# EAGLE design PGTNX02_2164_vcax4 (EAGLE 9.6.0)
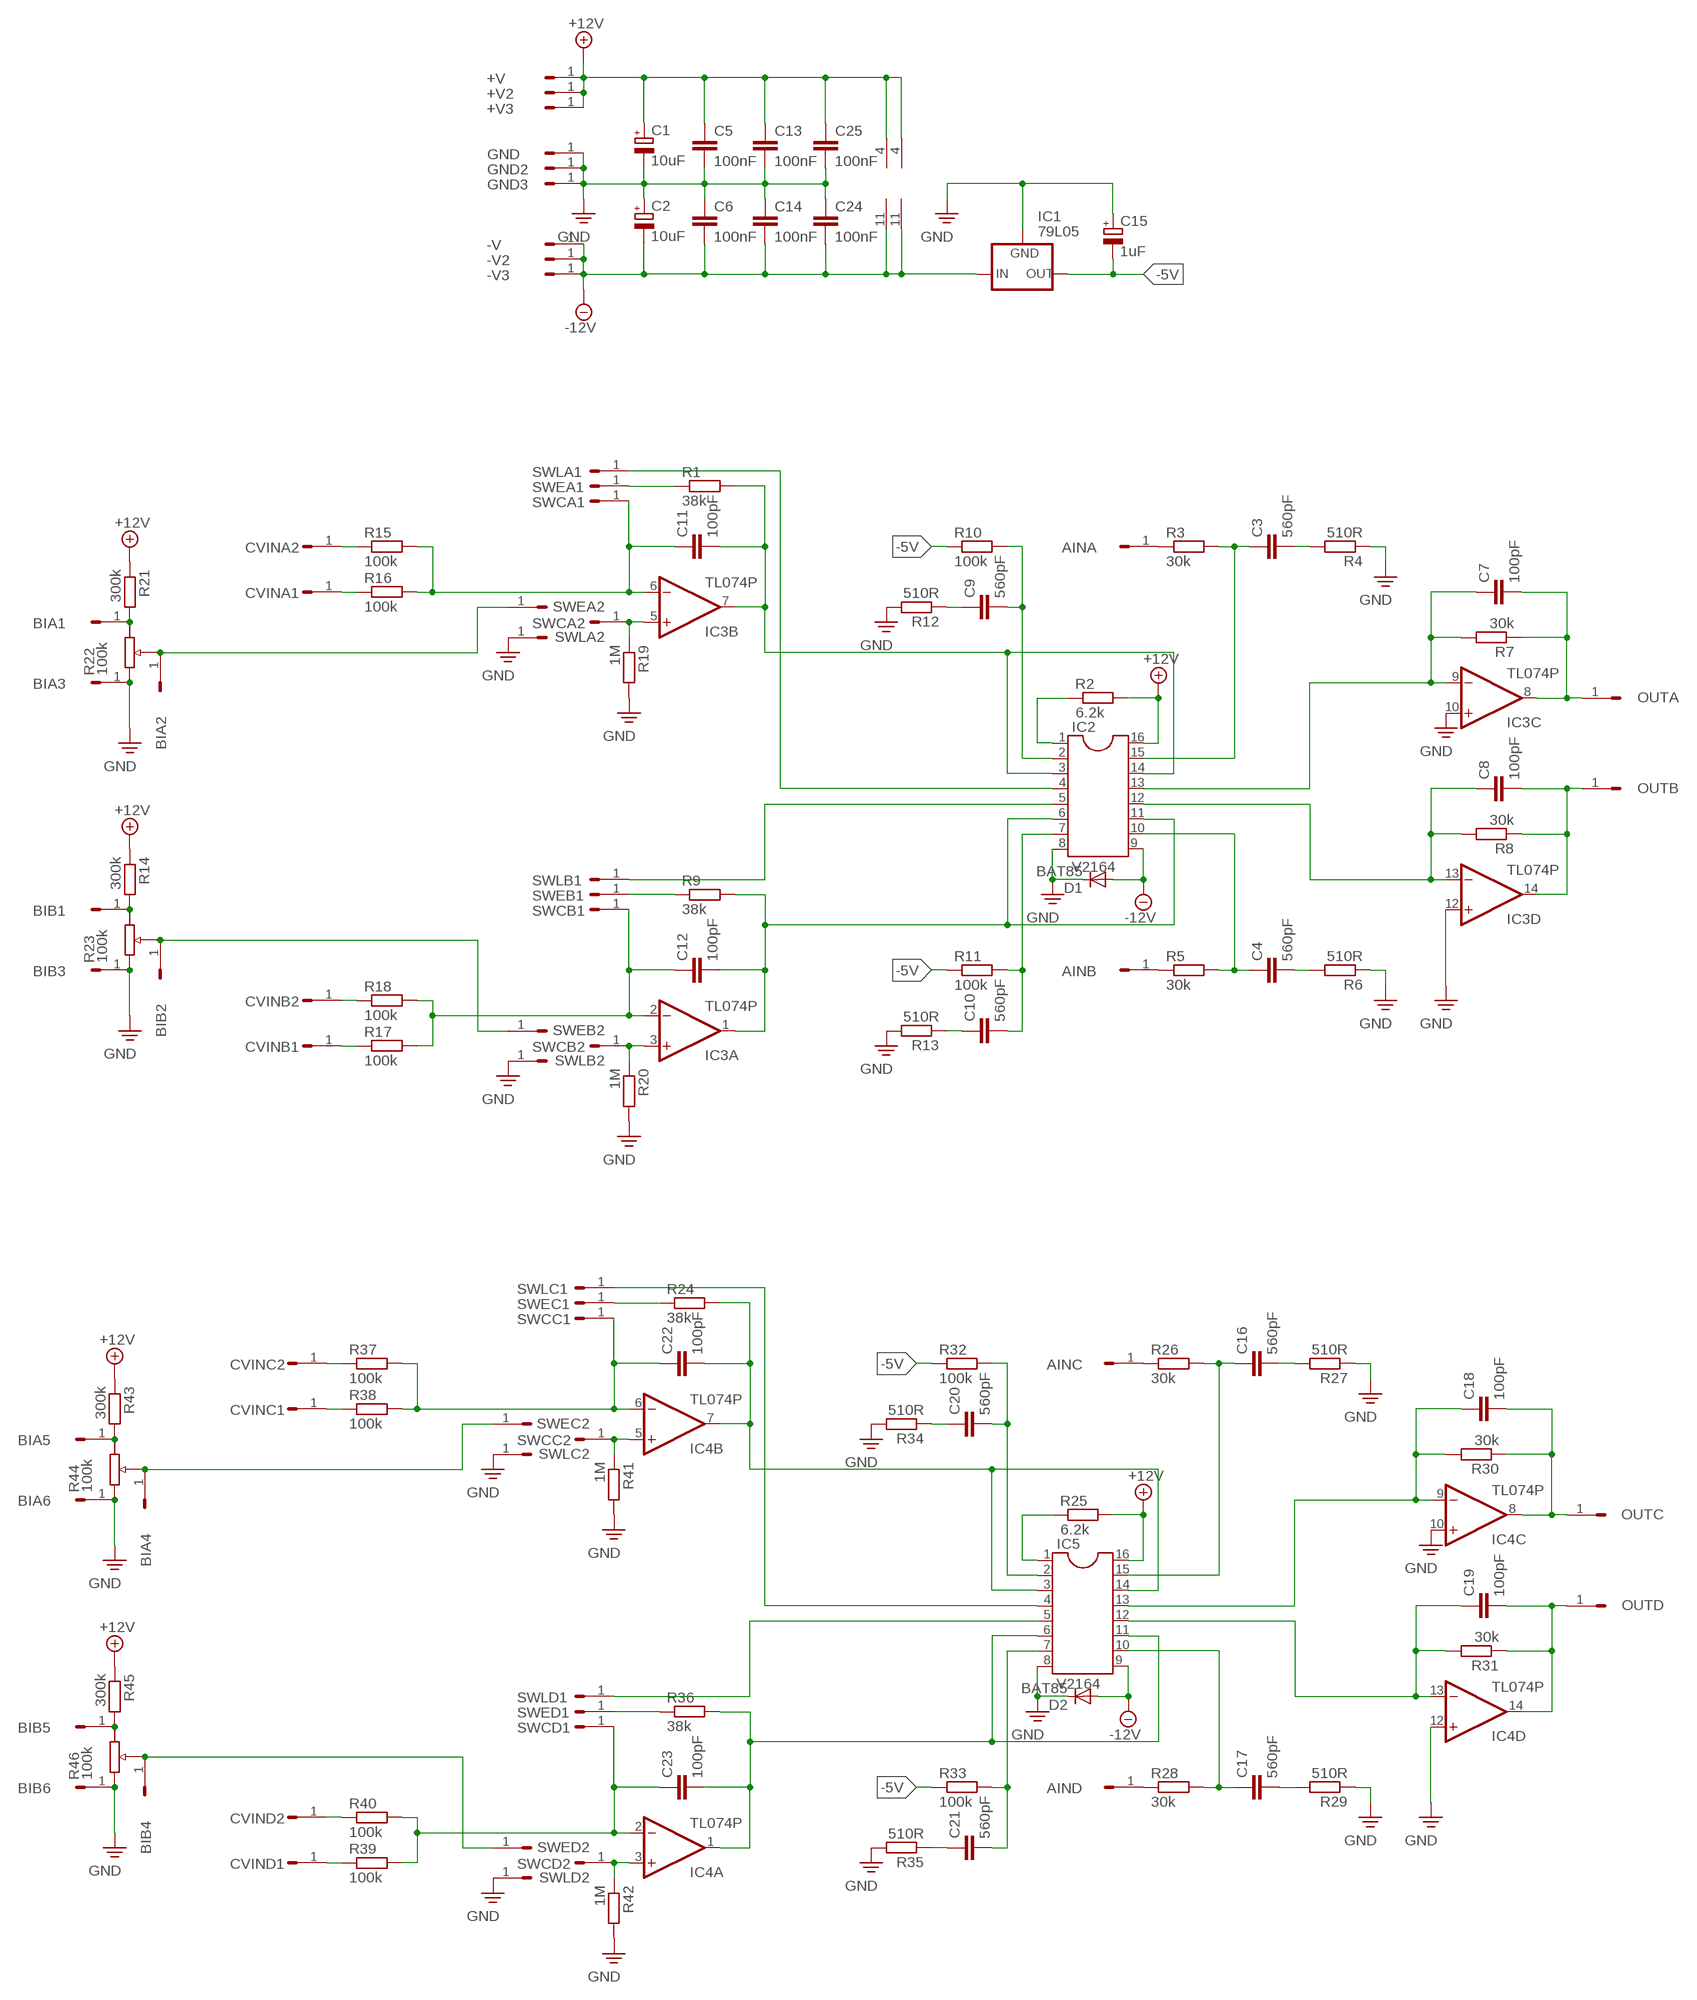
[diagram p0: schematic, sheet 1]

## Parts
+V  HEADER/MALE/01  [HEADER/MALE/01]
+V2  HEADER/MALE/01  [HEADER/MALE/01]
+V3  HEADER/MALE/01  [HEADER/MALE/01]
-V  HEADER/MALE/01  [HEADER/MALE/01]
-V2  HEADER/MALE/01  [HEADER/MALE/01]
-V3  HEADER/MALE/01  [HEADER/MALE/01]
AINA  HEADER/MALE/01  [HEADER/MALE/01]
AINB  HEADER/MALE/01  [HEADER/MALE/01]
AINC  HEADER/MALE/01  [HEADER/MALE/01]
AIND  HEADER/MALE/01  [HEADER/MALE/01]
BIA1  HEADER/MALE/01  [HEADER/MALE/01]
BIA2  HEADER/MALE/01  [HEADER/MALE/01]
BIA3  HEADER/MALE/01  [HEADER/MALE/01]
BIA4  HEADER/MALE/01  [HEADER/MALE/01]
BIA5  HEADER/MALE/01  [HEADER/MALE/01]
BIA6  HEADER/MALE/01  [HEADER/MALE/01]
BIB1  HEADER/MALE/01  [HEADER/MALE/01]
BIB2  HEADER/MALE/01  [HEADER/MALE/01]
BIB3  HEADER/MALE/01  [HEADER/MALE/01]
BIB4  HEADER/MALE/01  [HEADER/MALE/01]
BIB5  HEADER/MALE/01  [HEADER/MALE/01]
BIB6  HEADER/MALE/01  [HEADER/MALE/01]
C1  10uF  CAPACITOR/POLARIZEDE2.5-6  [E2,5-6]
C2  10uF  CAPACITOR/POLARIZEDE2.5-6  [E2,5-6]
C3  560pF  CAPACITORCERAMICDISC/5  [CERAMICDISC/5]
C4  560pF  CAPACITORCERAMICDISC/5  [CERAMICDISC/5]
C5  100nF  CAPACITORCERAMICDISC/5  [CERAMICDISC/5]
C6  100nF  CAPACITORCERAMICDISC/5  [CERAMICDISC/5]
C7  100pF  CAPACITORCERAMICDISC/5  [CERAMICDISC/5]
C8  100pF  CAPACITORCERAMICDISC/5  [CERAMICDISC/5]
C9  560pF  CAPACITORCERAMICDISC/5  [CERAMICDISC/5]
C10  560pF  CAPACITORCERAMICDISC/5  [CERAMICDISC/5]
C11  100pF  CAPACITORCERAMICDISC/5  [CERAMICDISC/5]
C12  100pF  CAPACITORCERAMICDISC/5  [CERAMICDISC/5]
C13  100nF  CAPACITORCERAMICDISC/5  [CERAMICDISC/5]
C14  100nF  CAPACITORCERAMICDISC/5  [CERAMICDISC/5]
C15  1uF  CAPACITOR/POLARIZEDE2.5-6  [E2,5-6]
C16  560pF  CAPACITORCERAMICDISC/5  [CERAMICDISC/5]
C17  560pF  CAPACITORCERAMICDISC/5  [CERAMICDISC/5]
C18  100pF  CAPACITORCERAMICDISC/5  [CERAMICDISC/5]
C19  100pF  CAPACITORCERAMICDISC/5  [CERAMICDISC/5]
C20  560pF  CAPACITORCERAMICDISC/5  [CERAMICDISC/5]
C21  560pF  CAPACITORCERAMICDISC/5  [CERAMICDISC/5]
C22  100pF  CAPACITORCERAMICDISC/5  [CERAMICDISC/5]
C23  100pF  CAPACITORCERAMICDISC/5  [CERAMICDISC/5]
C24  100nF  CAPACITORCERAMICDISC/5  [CERAMICDISC/5]
C25  100nF  CAPACITORCERAMICDISC/5  [CERAMICDISC/5]
CVINA1  HEADER/MALE/01  [HEADER/MALE/01]
CVINA2  HEADER/MALE/01  [HEADER/MALE/01]
CVINB1  HEADER/MALE/01  [HEADER/MALE/01]
CVINB2  HEADER/MALE/01  [HEADER/MALE/01]
CVINC1  HEADER/MALE/01  [HEADER/MALE/01]
CVINC2  HEADER/MALE/01  [HEADER/MALE/01]
CVIND1  HEADER/MALE/01  [HEADER/MALE/01]
CVIND2  HEADER/MALE/01  [HEADER/MALE/01]
D1  BAT85  1N4148DO35-7  [DO35-7]
D2  BAT85  1N4148DO35-7  [DO35-7]
GND  HEADER/MALE/01  [HEADER/MALE/01]
GND2  HEADER/MALE/01  [HEADER/MALE/01]
GND3  HEADER/MALE/01  [HEADER/MALE/01]
IC1  79L05  79LXX  [79LXX]
IC2  V2164  DIL16  [DIL16]
IC3  TL074P  [DIL14]
IC4  TL074P  [DIL14]
IC5  V2164  DIL16  [DIL16]
OUTA  HEADER/MALE/01  [HEADER/MALE/01]
OUTB  HEADER/MALE/01  [HEADER/MALE/01]
OUTC  HEADER/MALE/01  [HEADER/MALE/01]
OUTD  HEADER/MALE/01  [HEADER/MALE/01]
R1  38k  RESISTORRESISTOR/UPRIGHT/7.5  [RESISTOR/7.5]
R2  6.2k  RESISTORRESISTOR/UPRIGHT/7.5  [RESISTOR/7.5]
R3  30k  RESISTORRESISTOR/UPRIGHT/7.5  [RESISTOR/7.5]
R4  510R  RESISTORRESISTOR/UPRIGHT/7.5  [RESISTOR/7.5]
R5  30k  RESISTORRESISTOR/UPRIGHT/7.5  [RESISTOR/7.5]
R6  510R  RESISTORRESISTOR/UPRIGHT/7.5  [RESISTOR/7.5]
R7  30k  RESISTORRESISTOR/UPRIGHT/7.5  [RESISTOR/7.5]
R8  30k  RESISTORRESISTOR/UPRIGHT/7.5  [RESISTOR/7.5]
R9  38k  RESISTORRESISTOR/UPRIGHT/7.5  [RESISTOR/7.5]
R10  100k  RESISTORRESISTOR/UPRIGHT/7.5  [RESISTOR/7.5]
R11  100k  RESISTORRESISTOR/UPRIGHT/7.5  [RESISTOR/7.5]
R12  510R  RESISTORRESISTOR/UPRIGHT/7.5  [RESISTOR/7.5]
R13  510R  RESISTORRESISTOR/UPRIGHT/7.5  [RESISTOR/7.5]
R14  300k  RESISTORRESISTOR/UPRIGHT/7.5  [RESISTOR/7.5]
R15  100k  RESISTORRESISTOR/UPRIGHT/7.5  [RESISTOR/7.5]
R16  100k  RESISTORRESISTOR/UPRIGHT/7.5  [RESISTOR/7.5]
R17  100k  RESISTORRESISTOR/UPRIGHT/7.5  [RESISTOR/7.5]
R18  100k  RESISTORRESISTOR/UPRIGHT/7.5  [RESISTOR/7.5]
R19  1M  RESISTORRESISTOR/UPRIGHT/7.5  [RESISTOR/7.5]
R20  1M  RESISTORRESISTOR/UPRIGHT/7.5  [RESISTOR/7.5]
R21  300k  RESISTORRESISTOR/UPRIGHT/7.5  [RESISTOR/7.5]
R22  100k  POTENTIOMETER  (no package)
R23  100k  POTENTIOMETER  (no package)
R24  38k  RESISTORRESISTOR/UPRIGHT/7.5  [RESISTOR/7.5]
R25  6.2k  RESISTORRESISTOR/UPRIGHT/7.5  [RESISTOR/7.5]
R26  30k  RESISTORRESISTOR/UPRIGHT/7.5  [RESISTOR/7.5]
R27  510R  RESISTORRESISTOR/UPRIGHT/7.5  [RESISTOR/7.5]
R28  30k  RESISTORRESISTOR/UPRIGHT/7.5  [RESISTOR/7.5]
R29  510R  RESISTORRESISTOR/UPRIGHT/7.5  [RESISTOR/7.5]
R30  30k  RESISTORRESISTOR/UPRIGHT/7.5  [RESISTOR/7.5]
R31  30k  RESISTORRESISTOR/UPRIGHT/7.5  [RESISTOR/7.5]
R32  100k  RESISTORRESISTOR/UPRIGHT/7.5  [RESISTOR/7.5]
R33  100k  RESISTORRESISTOR/UPRIGHT/7.5  [RESISTOR/7.5]
R34  510R  RESISTORRESISTOR/UPRIGHT/7.5  [RESISTOR/7.5]
R35  510R  RESISTORRESISTOR/UPRIGHT/7.5  [RESISTOR/7.5]
R36  38k  RESISTORRESISTOR/UPRIGHT/7.5  [RESISTOR/7.5]
R37  100k  RESISTORRESISTOR/UPRIGHT/7.5  [RESISTOR/7.5]
R38  100k  RESISTORRESISTOR/UPRIGHT/7.5  [RESISTOR/7.5]
R39  100k  RESISTORRESISTOR/UPRIGHT/7.5  [RESISTOR/7.5]
R40  100k  RESISTORRESISTOR/UPRIGHT/7.5  [RESISTOR/7.5]
R41  1M  RESISTORRESISTOR/UPRIGHT/7.5  [RESISTOR/7.5]
R42  1M  RESISTORRESISTOR/UPRIGHT/7.5  [RESISTOR/7.5]
R43  300k  RESISTORRESISTOR/UPRIGHT/7.5  [RESISTOR/7.5]
R44  100k  POTENTIOMETER  (no package)
R45  300k  RESISTORRESISTOR/UPRIGHT/7.5  [RESISTOR/7.5]
R46  100k  POTENTIOMETER  (no package)
SWCA1  HEADER/MALE/01  [HEADER/MALE/01]
SWCA2  HEADER/MALE/01  [HEADER/MALE/01]
SWCB1  HEADER/MALE/01  [HEADER/MALE/01]
SWCB2  HEADER/MALE/01  [HEADER/MALE/01]
SWCC1  HEADER/MALE/01  [HEADER/MALE/01]
SWCC2  HEADER/MALE/01  [HEADER/MALE/01]
SWCD1  HEADER/MALE/01  [HEADER/MALE/01]
SWCD2  HEADER/MALE/01  [HEADER/MALE/01]
SWEA1  HEADER/MALE/01  [HEADER/MALE/01]
SWEA2  HEADER/MALE/01  [HEADER/MALE/01]
SWEB1  HEADER/MALE/01  [HEADER/MALE/01]
SWEB2  HEADER/MALE/01  [HEADER/MALE/01]
SWEC1  HEADER/MALE/01  [HEADER/MALE/01]
SWEC2  HEADER/MALE/01  [HEADER/MALE/01]
SWED1  HEADER/MALE/01  [HEADER/MALE/01]
SWED2  HEADER/MALE/01  [HEADER/MALE/01]
SWLA1  HEADER/MALE/01  [HEADER/MALE/01]
SWLA2  HEADER/MALE/01  [HEADER/MALE/01]
SWLB1  HEADER/MALE/01  [HEADER/MALE/01]
SWLB2  HEADER/MALE/01  [HEADER/MALE/01]
SWLC1  HEADER/MALE/01  [HEADER/MALE/01]
SWLC2  HEADER/MALE/01  [HEADER/MALE/01]
SWLD1  HEADER/MALE/01  [HEADER/MALE/01]
SWLD2  HEADER/MALE/01  [HEADER/MALE/01]

## Nets
+12V: +V2.1 +V3.1 +V.1 C1.+ C5.1 C13.1 C25.1 IC2.16 IC3.4(P:V+) IC4.4(P:V+) IC5.16 R2.2 R14.1 R21.1 R25.2 R43.1 R45.1
-5V: C15.- IC1.OUT R10.1 R11.1 R32.1 R33.1
-12V: -V2.1 -V3.1 -V.1 C2.- C6.2 C14.2 C24.2 D1.A D2.A IC1.IN IC2.9 IC3.11(P:V-) IC4.11(P:V-) IC5.9
N$1: C9.2 IC2.2 R10.2
N$2: IC2.1 R2.1
N$3: AINA.1 R3.1
N$4: C3.1 IC2.15 R3.2
N$5: C3.2 R4.2
N$6: C7.1 IC2.13 IC3.9(C:-IN) R7.2
N$7: AINB.1 R5.1
N$8: C4.1 IC2.10 R5.2
N$9: C4.2 R6.2
N$10: C8.1 IC2.12 IC3.13(D:-IN) R8.2
N$11: C10.2 IC2.7 R11.2
N$12: C9.1 R12.1
N$13: C8.2 IC3.14(D:OUT) OUTB.1 R8.1
N$14: C7.2 IC3.8(C:OUT) OUTA.1 R7.1
N$15: R1.1 SWEA1.1
N$16: C11.1 IC3.6(B:-IN) R15.2 R16.2 SWCA1.1
N$17: C10.1 R13.1
N$18: C12.2 IC2.6 IC2.11 IC3.1(A:OUT) R9.2
N$19: IC2.4 SWLA1.1
N$20: C11.2 IC2.3 IC2.14 IC3.7(B:OUT) R1.2
N$21: BIB2.1 R23.S SWEB2.1
N$22: CVINA2.1 R15.1
N$23: CVINA1.1 R16.1
N$24: CVINB1.1 R17.1
N$25: CVINB2.1 R18.1
N$26: C12.1 IC3.2(A:-IN) R17.2 R18.2 SWCB1.1
N$27: R9.1 SWEB1.1
N$28: IC2.5 SWLB1.1
N$29: IC3.5(B:+IN) R19.1 SWCA2.1
N$30: IC3.3(A:+IN) R20.1 SWCB2.1
N$31: BIA1.1 R21.2 R22.A
N$32: IC5.1 R25.1
N$33: BIB1.1 R14.2 R23.A
N$34: BIA2.1 R22.S SWEA2.1
N$35: AINC.1 R26.1
N$36: C16.1 IC5.15 R26.2
N$37: C16.2 R27.2
N$38: AIND.1 R28.1
N$39: C17.1 IC5.10 R28.2
N$40: C17.2 R29.2
N$41: C18.1 IC4.9(C:-IN) IC5.13 R30.2
N$42: C19.1 IC4.13(D:-IN) IC5.12 R31.2
N$43: C19.2 IC4.14(D:OUT) OUTD.1 R31.1
N$44: C18.2 IC4.8(C:OUT) OUTC.1 R30.1
N$45: C20.2 IC5.2 R32.2
N$46: C21.2 IC5.7 R33.2
N$47: C20.1 R34.1
N$48: C21.1 R35.1
N$49: C22.2 IC4.7(B:OUT) IC5.3 IC5.14 R24.2
N$50: BIB4.1 R46.S SWED2.1
N$51: CVINC2.1 R37.1
N$52: CVINC1.1 R38.1
N$53: CVIND1.1 R39.1
N$54: CVIND2.1 R40.1
N$55: C23.1 IC4.2(A:-IN) R39.2 R40.2 SWCD1.1
N$56: C23.2 IC4.1(A:OUT) IC5.6 IC5.11 R36.2
N$57: R24.1 SWEC1.1
N$58: C22.1 IC4.6(B:-IN) R37.2 R38.2 SWCC1.1
N$59: IC5.4 SWLC1.1
N$60: R36.1 SWED1.1
N$61: IC5.5 SWLD1.1
N$62: IC4.5(B:+IN) R41.1 SWCC2.1
N$63: IC4.3(A:+IN) R42.1 SWCD2.1
N$64: BIA5.1 R43.2 R44.A
N$65: BIB5.1 R45.2 R46.A
N$66: BIA4.1 R44.S SWEC2.1
PE: BIA3.1 BIA6.1 BIB3.1 BIB6.1 C1.- C2.+ C5.2 C6.1 C13.2 C14.1 C15.+ C24.1 C25.2 D1.C D2.C GND2.1 GND3.1 GND.1 IC1.GND IC2.8 IC3.10(C:+IN) IC3.12(D:+IN) IC4.10(C:+IN) IC4.12(D:+IN) IC5.8 R4.1 R6.1 R12.2 R13.2 R19.2 R20.2 R22.E R23.E R27.1 R29.1 R34.2 R35.2 R41.2 R42.2 R44.E R46.E SWLA2.1 SWLB2.1 SWLC2.1 SWLD2.1 ; supply symbol labelled GND

## Library data of the parts
+V +V2 +V3 -V -V2 -V3 GND GND2 GND3 = connectors:HEADER/MALE/01; SPICEPREFIX: X
AINA AINB AINC AIND BIA1-BIA6 BIB1-BIB6 CVINA1 CVINA2 CVINB1 CVINB2 CVINC1 CVINC2 CVIND1 CVIND2 OUTA OUTB OUTC OUTD SWCA1 SWCA2 SWCB1 SWCB2 SWCC1 SWCC2 SWCD1 SWCD2 SWEA1 SWEA2 SWEB1 SWEB2 SWEC1 SWEC2 SWED1 SWED2 SWLA1 SWLA2 SWLB1 SWLB2 SWLC1 SWLC2 SWLD1 SWLD2 = connectors:HEADER/MALE/01
C1 C2 C15 = capacitors:CAPACITOR/POLARIZED: POLARIZED CAPACITOR, European symbol; SPICEPREFIX: C
C3-C14 C16-C25 = capacitors:CAPACITOR: CAPACITOR, European symbol
D1 D2 = transistors:1N4148: DIODE high speed (Philips)
IC1 = v-reg:79LXX: VOLTAGE REGULATOR
IC2 IC5 = ic_package:DIL16: Dual In Line / Socket
IC3 IC4 = ic_analogue:TL074: OP AMP
R1-R21 R24-R43 R45 = resistors:RESISTOR: RESISTOR, European symbol
R22 R23 R44 R46 = controls_off_brd:POTENTIOMETER: Trimm resistor; _EXTERNAL_: 1

## Board
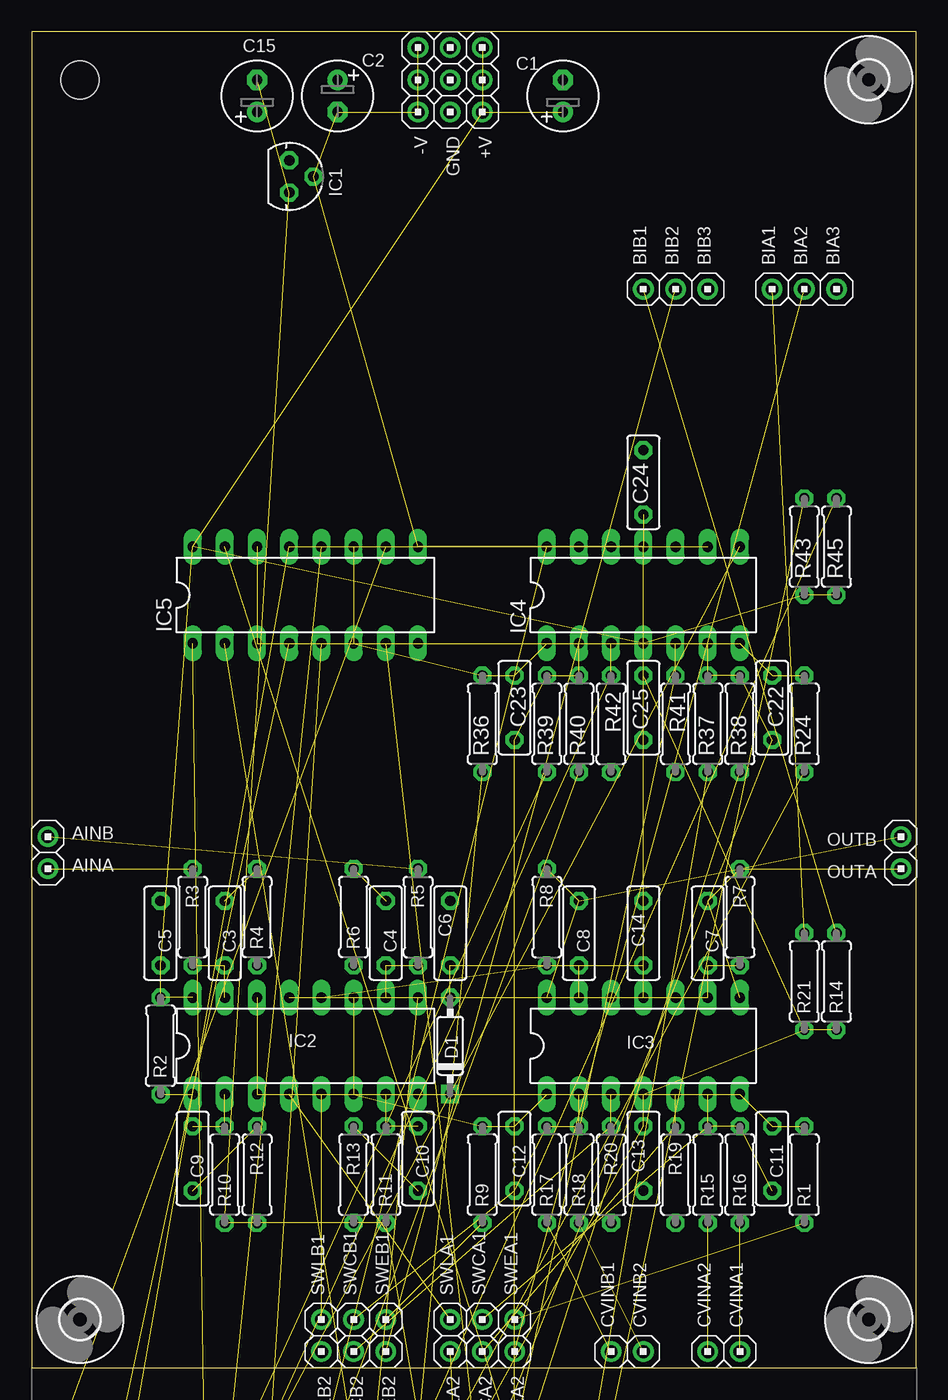
[diagram p1: board, top side]
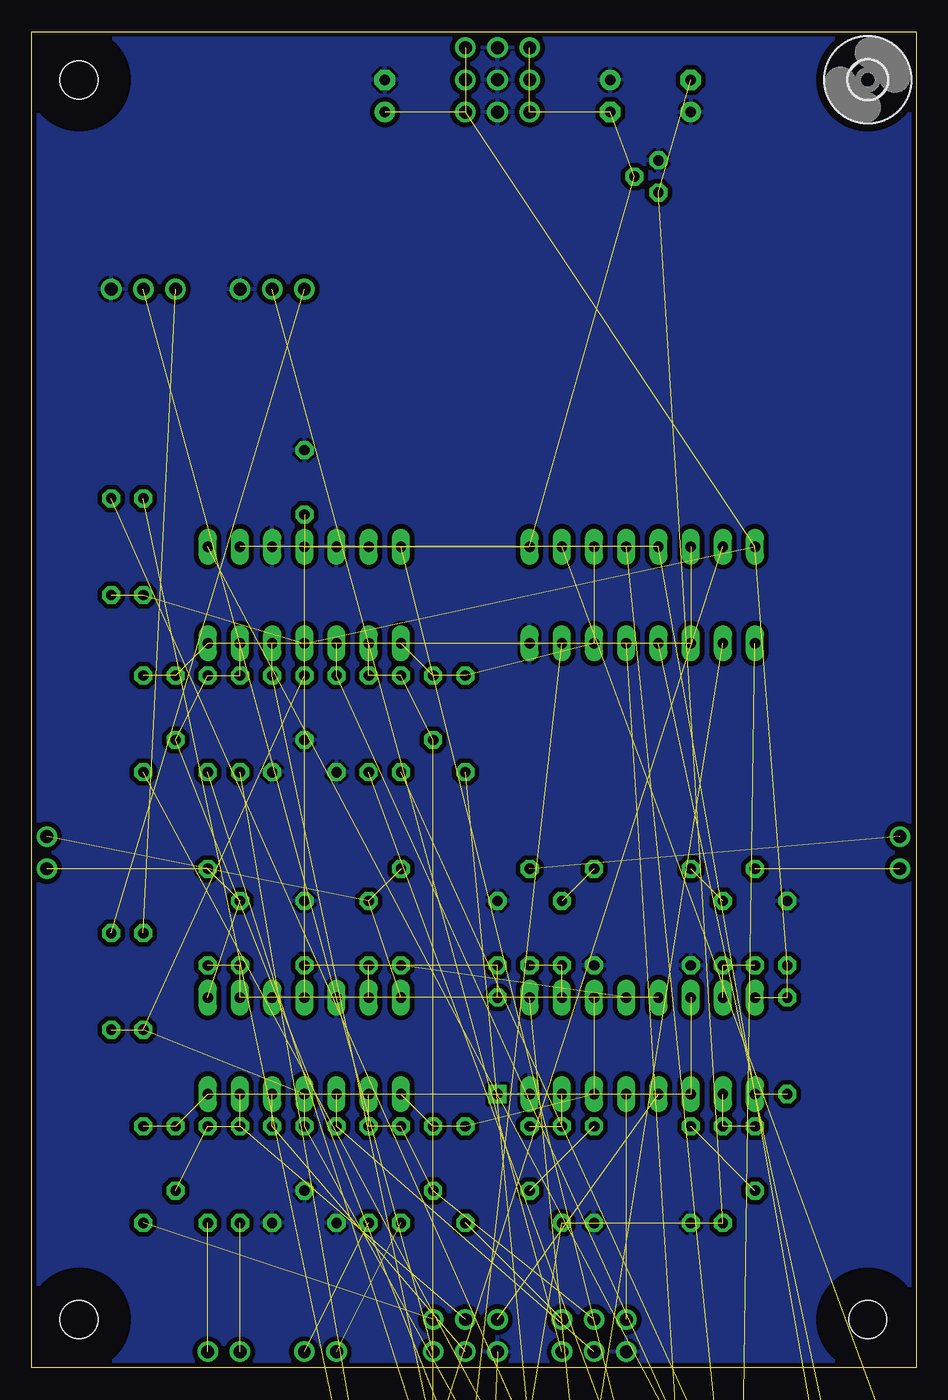
[diagram p2: board, bottom side, seen from below]

Size 69.77 x 105.4 mm. Coordinates in mm from the lower left corner, seen from the top.
Outline: 0,0 69.77,0 69.77,105.4 0,105.4 0,0
Copper layers (1*16): Top 0.0356mm / dielectric 1.5011mm / Bottom 0.0356mm
Design rules "pigatron": minimum track width 12mil, minimum drill 13mil, track to track 15mil, track to pad 10mil, pad to pad 10mil, via to via 10mil, smd to smd 6mil, copper to edge 15mil, drill to drill 10mil, minimum pad ring 12mil, minimum via ring 10mil, stop-mask expansion 4mil, vias tented up to drill 0mil, thermal gap 10mil

### Footprints (pad centres in the part's own frame; a part is rotated, then mirrored left to right if it is on the bottom)
HEADER/MALE/01 = drill 1.016: 1 0,0
E2,5-6 = drill 0.813 pad 1.6: + -1.27,0 | drill 0.813 pad 1.6 octagon: - 1.27,0
CERAMICDISC/5 = drill 0.813 octagon: 1 -2.54,0; 2 2.54,0
DO35-7 = drill 0.813 octagon: A 3.81,0 | drill 0.813 square: C -3.81,0
79LXX = drill 0.813 octagon: GND -1.27,0; IN 0,1.905; OUT 1.27,0
DIL16 = drill 0.813 long: 1 -8.89,-3.81; 2 -6.35,-3.81; 3 -3.81,-3.81; 4 -1.27,-3.81; 5 1.27,-3.81; 6 3.81,-3.81; 7 6.35,-3.81; 8 8.89,-3.81; 9 8.89,3.81; 10 6.35,3.81; 11 3.81,3.81; 12 1.27,3.81; 13 -1.27,3.81; 14 -3.81,3.81; 15 -6.35,3.81; 16 -8.89,3.81
DIL14 = drill 0.813 long: 1 -7.62,-3.81; 2 -5.08,-3.81; 3 -2.54,-3.81; 4 0,-3.81; 5 2.54,-3.81; 6 5.08,-3.81; 7 7.62,-3.81; 8 7.62,3.81; 9 5.08,3.81; 10 2.54,3.81; 11 0,3.81; 12 -2.54,3.81; 13 -5.08,3.81; 14 -7.62,3.81
RESISTOR/7.5 = drill 0.813 octagon: 1 -3.81,0; 2 3.81,0
STANDOFF/3.0 = hole 3: 0,0

### Placement (x,y rotation side)
+V  35.56,99.06 270 top
+V2  35.56,101.6 270 top
+V3  35.56,104.14 270 top
-V  30.48,99.06 270 top
-V2  30.48,101.6 270 top
-V3  30.48,104.14 270 top
AINA  1.27,39.37 0 top
AINB  1.27,41.91 0 top
AINC  5.08,-64.77 0 top  (outside the outline)
AIND  15.24,-64.77 0 top  (outside the outline)
BIA1  58.42,85.09 90 top
BIA2  60.96,85.09 90 top
BIA3  63.5,85.09 90 top
BIA4  25.4,-64.77 0 top  (outside the outline)
BIA5  33.02,-64.77 0 top  (outside the outline)
BIA6  40.64,-64.77 0 top  (outside the outline)
BIB1  48.26,85.09 90 top
BIB2  50.8,85.09 90 top
BIB3  53.34,85.09 90 top
BIB4  -5.08,-68.58 0 top  (outside the outline)
BIB5  2.54,-68.58 0 top  (outside the outline)
BIB6  10.16,-68.58 0 top  (outside the outline)
C1  41.91,100.33 90 top
C2  24.13,100.33 270 top
C3  15.24,34.29 90 top
C4  27.94,34.29 90 top
C5  10.16,34.29 90 top
C6  33.02,34.29 270 top
C7  53.34,34.29 90 top
C8  43.18,34.29 90 top
C9  12.7,16.51 90 top
C10  30.48,16.51 90 top
C11  58.42,16.51 90 top
C12  38.1,16.51 90 top
C13  48.26,16.51 270 top
C14  48.26,34.29 270 top
C15  17.78,100.33 90 top
C16  41.91,-10.16 0 top  (outside the outline)
C17  -1.27,-21.59 0 top  (outside the outline)
C18  7.62,-21.59 0 top  (outside the outline)
C19  16.51,-21.59 0 top  (outside the outline)
C20  25.4,-21.59 0 top  (outside the outline)
C21  34.29,-21.59 0 top  (outside the outline)
C22  58.42,52.07 90 top
C23  38.1,52.07 90 top
C24  48.26,69.85 270 top
C25  48.26,52.07 270 top
CVINA1  55.88,1.27 90 top
CVINA2  53.34,1.27 90 top
CVINB1  45.72,1.27 90 top
CVINB2  48.26,1.27 90 top
CVINC1  25.4,-48.26 0 top  (outside the outline)
CVINC2  36.83,-48.26 0 top  (outside the outline)
CVIND1  -5.08,-53.34 0 top  (outside the outline)
CVIND2  6.35,-53.34 0 top  (outside the outline)
D1  33.02,25.4 90 top
D2  19.05,-46.99 0 top  (outside the outline)
GND  33.02,99.06 270 top
GND2  33.02,104.14 270 top
GND3  33.02,101.6 270 top
IC1  20.32,93.98 270 top
IC2  21.59,25.4 0 top
IC3  48.26,25.4 0 top
IC4  48.26,60.96 0 top
IC5  21.59,60.96 0 top
OUTA  68.58,39.37 180 top
OUTB  68.58,41.91 180 top
OUTC  -5.08,-64.77 0 top  (outside the outline)
OUTD  35.56,-60.96 0 top  (outside the outline)
R1  60.96,15.24 90 top
R2  10.16,25.4 90 top
R3  12.7,35.56 270 top
R4  17.78,35.56 90 top
R5  30.48,35.56 270 top
R6  25.4,35.56 90 top
R7  55.88,35.56 270 top
R8  40.64,35.56 270 top
R9  35.56,15.24 90 top
R10  15.24,15.24 90 top
R11  27.94,15.24 90 top
R12  17.78,15.24 270 top
R13  25.4,15.24 270 top
R14  63.5,30.48 90 top
R15  53.34,15.24 90 top
R16  55.88,15.24 90 top
R17  40.64,15.24 90 top
R18  43.18,15.24 90 top
R19  50.8,15.24 270 top
R20  45.72,15.24 270 top
R21  60.96,30.48 90 top
R24  60.96,50.8 90 top
R25  17.78,-29.21 0 top  (outside the outline)
R26  27.94,-29.21 0 top  (outside the outline)
R27  38.1,-29.21 0 top  (outside the outline)
R28  -1.27,-34.29 0 top  (outside the outline)
R29  8.89,-34.29 0 top  (outside the outline)
R30  19.05,-34.29 0 top  (outside the outline)
R31  29.21,-34.29 0 top  (outside the outline)
R32  39.37,-34.29 0 top  (outside the outline)
R33  -1.27,-39.37 0 top  (outside the outline)
R34  8.89,-39.37 0 top  (outside the outline)
R35  19.05,-39.37 0 top  (outside the outline)
R36  35.56,50.8 90 top
R37  53.34,50.8 90 top
R38  55.88,50.8 90 top
R39  40.64,50.8 90 top
R40  43.18,50.8 90 top
R41  50.8,50.8 270 top
R42  45.72,50.8 270 top
R43  60.96,64.77 90 top
R45  63.5,64.77 90 top
SWCA1  35.56,3.81 90 top
SWCA2  35.56,1.27 270 top
SWCB1  25.4,3.81 90 top
SWCB2  25.4,1.27 270 top
SWCC1  17.78,-53.34 0 top  (outside the outline)
SWCC2  27.94,-53.34 0 top  (outside the outline)
SWCD1  38.1,-53.34 0 top  (outside the outline)
SWCD2  -5.08,-57.15 0 top  (outside the outline)
SWEA1  38.1,3.81 90 top
SWEA2  38.1,1.27 270 top
SWEB1  27.94,3.81 90 top
SWEB2  27.94,1.27 270 top
SWEC1  5.08,-57.15 0 top  (outside the outline)
SWEC2  15.24,-57.15 0 top  (outside the outline)
SWED1  25.4,-57.15 0 top  (outside the outline)
SWED2  35.56,-57.15 0 top  (outside the outline)
SWLA1  33.02,3.81 90 top
SWLA2  33.02,1.27 270 top
SWLB1  22.86,3.81 90 top
SWLB2  22.86,1.27 270 top
SWLC1  -5.08,-60.96 0 top  (outside the outline)
SWLC2  5.08,-60.96 0 top  (outside the outline)
SWLD1  15.24,-60.96 0 top  (outside the outline)
SWLD2  25.4,-60.96 0 top  (outside the outline)
U$1  [STANDOFF/3.0]  3.81,3.81 0 top
U$2  [STANDOFF/3.0]  66.04,3.81 0 top
U$3  [STANDOFF/3.0]  3.81,101.6 0 bottom
U$4  [STANDOFF/3.0]  66.04,101.6 0 top
U$5  [PIGATRON-LOGO]  81.66,14.86 90 top  (outside the outline)

### Tracks (layer width: path | path; a pad name or v marks a point on that pad's centre or on a via)
+12V  (16 unrouted)
-5V  (5 unrouted)
-12V  (13 unrouted)
N$1  (2 unrouted)
N$2  (1 unrouted)
N$3  (1 unrouted)
N$4  (2 unrouted)
N$5  (1 unrouted)
N$6  (3 unrouted)
N$7  (1 unrouted)
N$8  (2 unrouted)
N$9  (1 unrouted)
N$10  (3 unrouted)
N$11  (2 unrouted)
N$12  (1 unrouted)
N$13  (3 unrouted)
N$14  (3 unrouted)
N$15  (1 unrouted)
N$16  (4 unrouted)
N$17  (1 unrouted)
N$18  (4 unrouted)
N$19  (1 unrouted)
N$20  (4 unrouted)
N$21  (1 unrouted)
N$22  (1 unrouted)
N$23  (1 unrouted)
N$24  (1 unrouted)
N$25  (1 unrouted)
N$26  (4 unrouted)
N$27  (1 unrouted)
N$28  (1 unrouted)
N$29  (2 unrouted)
N$30  (2 unrouted)
N$31  (1 unrouted)
N$32  (1 unrouted)
N$33  (1 unrouted)
N$34  (1 unrouted)
N$35  (1 unrouted)
N$36  (2 unrouted)
N$37  (1 unrouted)
N$38  (1 unrouted)
N$39  (2 unrouted)
N$40  (1 unrouted)
N$41  (3 unrouted)
N$42  (3 unrouted)
N$43  (3 unrouted)
N$44  (3 unrouted)
N$45  (2 unrouted)
N$46  (2 unrouted)
N$47  (1 unrouted)
N$48  (1 unrouted)
N$49  (4 unrouted)
N$50  (1 unrouted)
N$51  (1 unrouted)
N$52  (1 unrouted)
N$53  (1 unrouted)
N$54  (1 unrouted)
N$55  (4 unrouted)
N$56  (4 unrouted)
N$57  (1 unrouted)
N$58  (4 unrouted)
N$59  (1 unrouted)
N$60  (1 unrouted)
N$61  (1 unrouted)
N$62  (2 unrouted)
N$63  (2 unrouted)
N$64  (1 unrouted)
N$65  (1 unrouted)
N$66  (1 unrouted)
PE  (9 unrouted)
  pour Bottom: 0,105.41 0,0 69.85,0 69.85,105.41

### Text on the board
tDocu: Rob Ellis 2020 | PGTNX02 | 2164_VCA